# Altium schematic sheet LTEW_User_Interface.SchDoc: LTEW_User_Interface
size 420 x 297 mm; Author: Tristan Traiber; CompanyName: HES-SO; DrawnBy: Tristan Traiber; Engineer: Tristan Traiber; Organization: MSE HES-SO; Address1: HEVS; Address3: Tristan Traiber; DocumentNumber: 5; Revision: 1.0; SheetNumber: 5; SheetTotal: 6
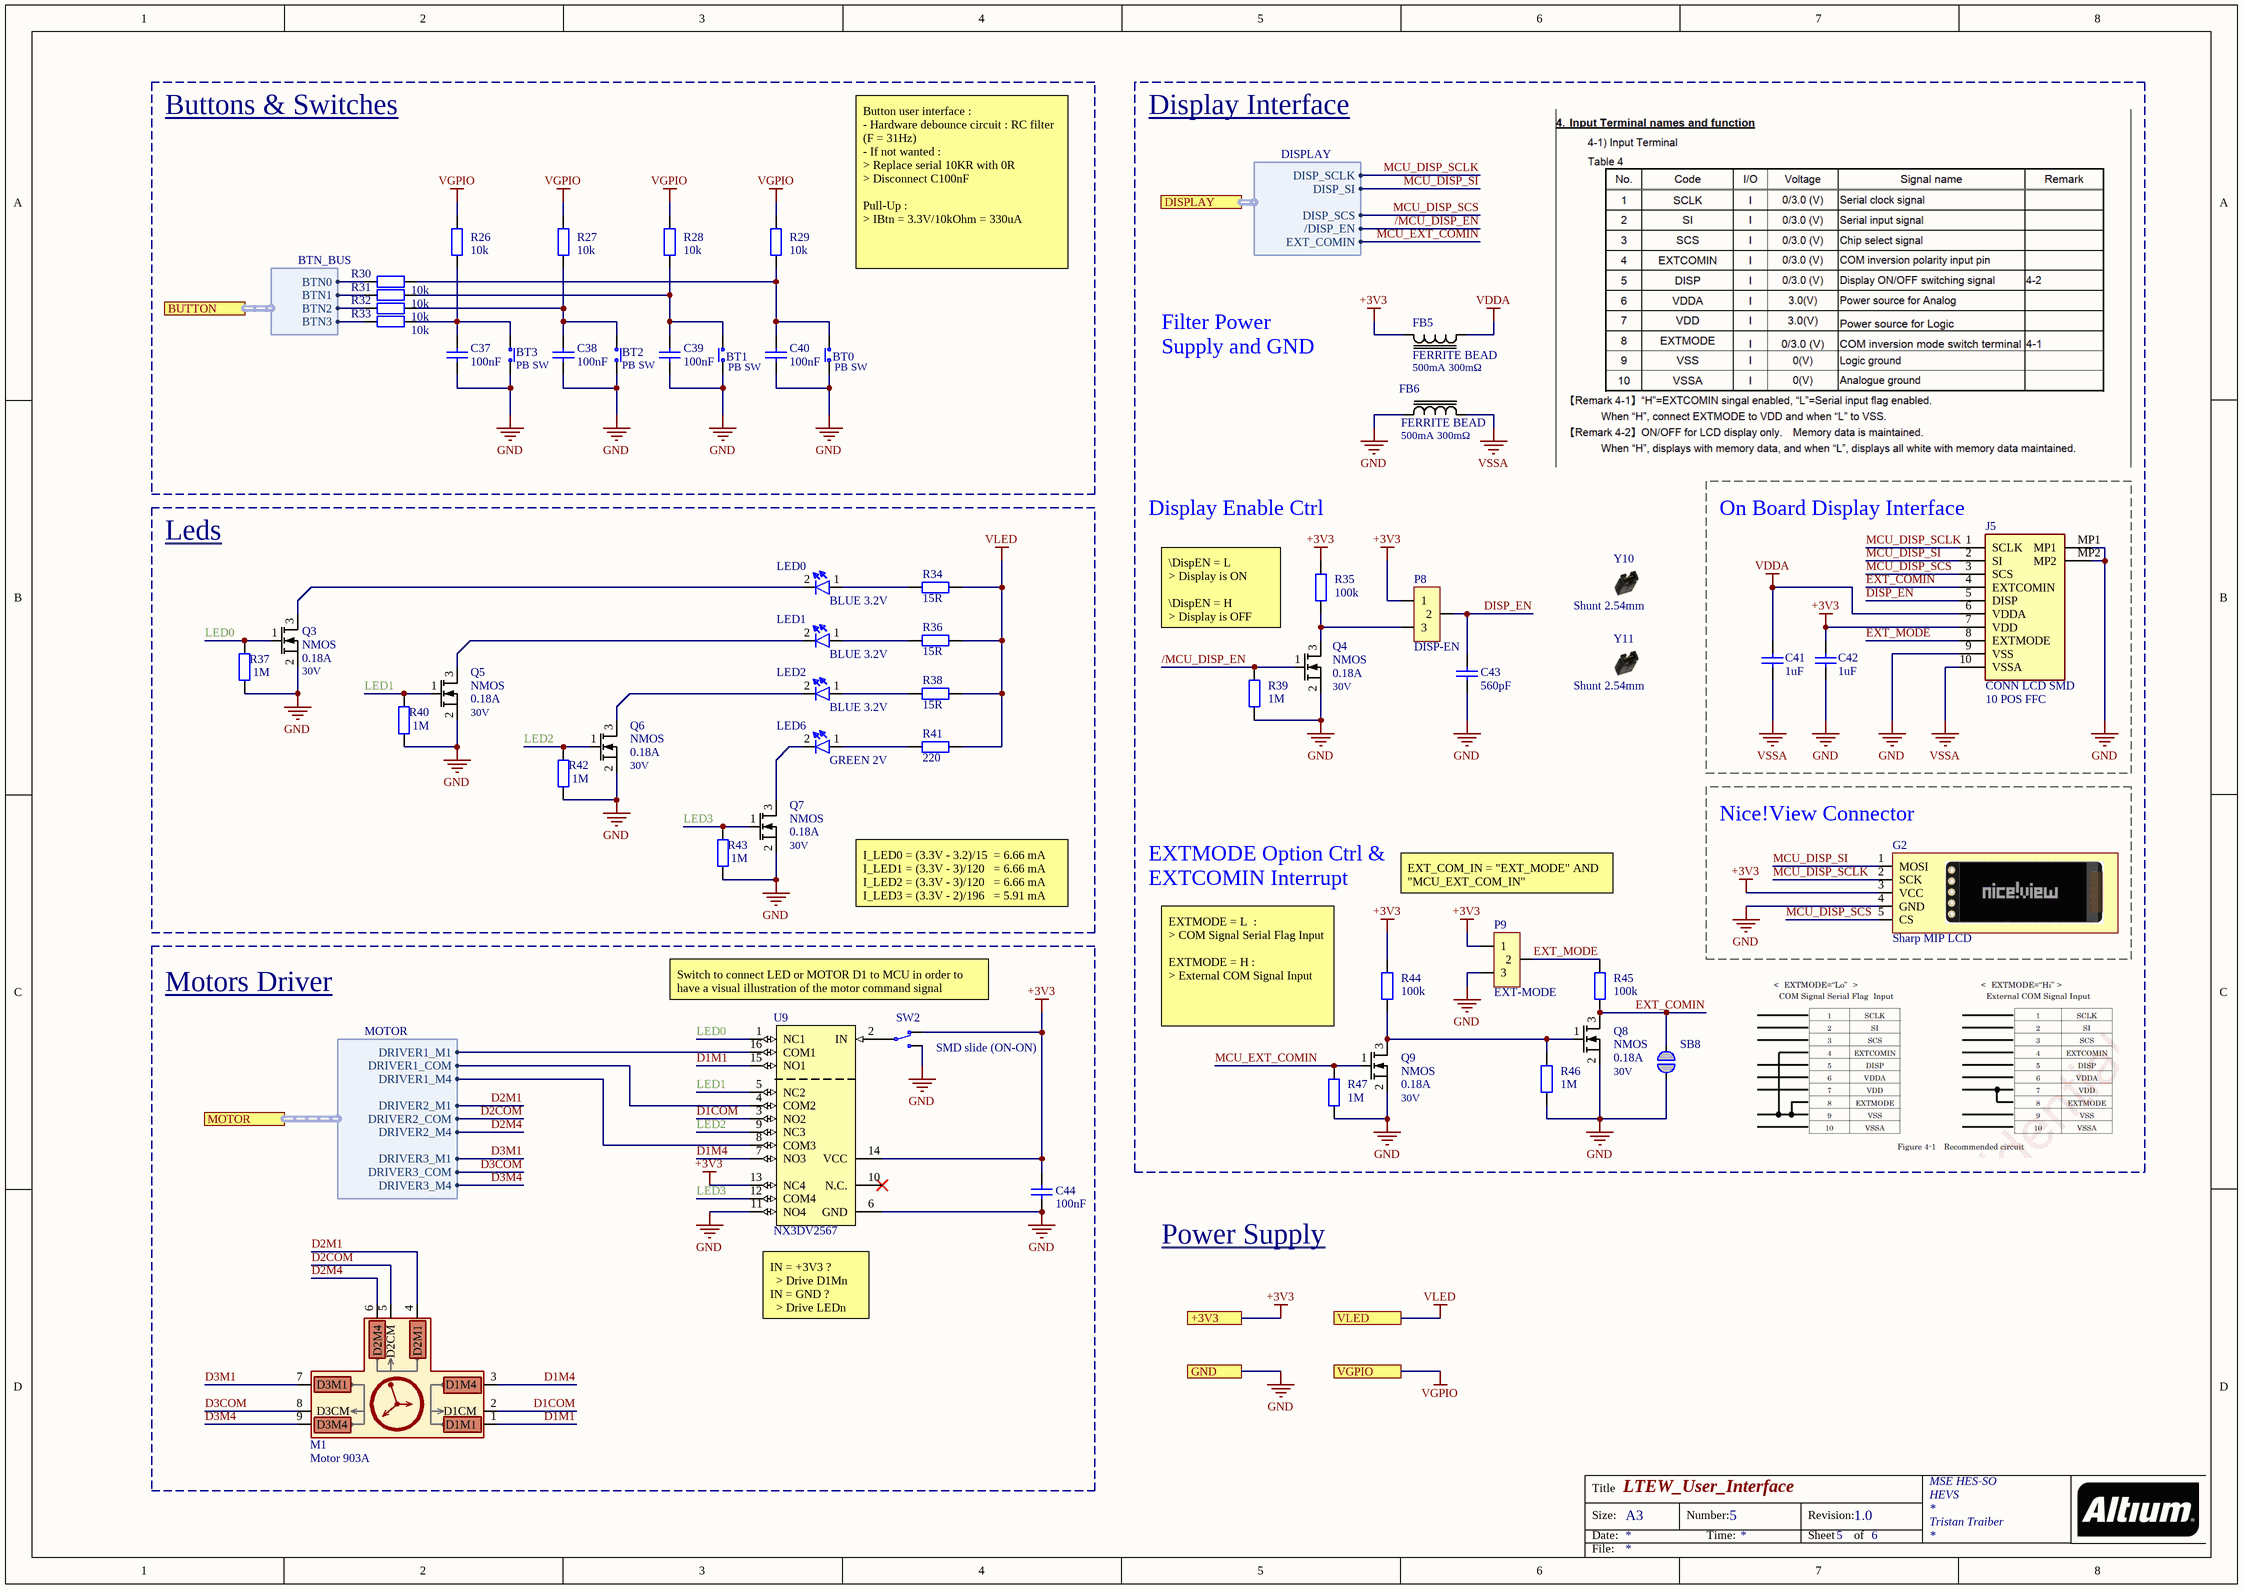
[diagram p0: LTEW_User_Interface.SchDoc]

## Parts
BT0  value PB SW  [Switch-PB-SMD-BT0]  (hidden comment: SKHUALE010)
BT1  value PB SW  [Switch-PB-SMD-BT1]  (hidden comment: SKHUALE010)
BT2  value PB SW  [Switch-PB-SMD-BT2]  (hidden comment: SKHUALE010)
BT3  value PB SW  [Switch-PB-SMD-BT3]  (hidden comment: SKHUALE010)
C37  100nF  [C0603]
C38  100nF  [C0603]
C39  100nF  [C0603]
C40  100nF  [C0603]
C41  1uF  [C0603]
C42  1uF  [C0603]
C43  560pF  [C0603]
C44  100nF  [C0603]
FB5  FERRITE BEAD  value 500mA 300mΩ  [BEADC2012X110N]
FB6  FERRITE BEAD  value 500mA 300mΩ  [BEADC2012X110N]
G2  Sharp MIP LCD  [SHARP_MIP_LCD]
J5  CONN LCD SMD  value 10 POS FFC  [FH12A10S05SH55]
LED0  BLUE 3.2V  [LEDC1608X80N]
LED1  BLUE 3.2V  [LEDC1608X80N]
LED2  BLUE 3.2V  [LEDC1608X80N]
LED6  GREEN 2V  [LEDC1608X80N]
M1  Motor 903A  [MOTOR]  (mechanical)
P8  DISP-EN  [HDR1X3 - DISP_EN]
P9  EXT-MODE  [HDR1X3 - EXT_MODE]
Q3  NMOS  value 30V  Value2: 0.18A  [SOT65P210X110-3N]
Q4  NMOS  value 30V  Value2: 0.18A  [SOT65P210X110-3N]
Q5  NMOS  value 30V  Value2: 0.18A  [SOT65P210X110-3N]
Q6  NMOS  value 30V  Value2: 0.18A  [SOT65P210X110-3N]
Q7  NMOS  value 30V  Value2: 0.18A  [SOT65P210X110-3N]
Q8  NMOS  value 30V  Value2: 0.18A  [SOT65P210X110-3N]
Q9  NMOS  value 30V  Value2: 0.18A  [SOT65P210X110-3N]
R26  10k  [RES0603]
R27  10k  [RES0603]
R28  10k  [RES0603]
R29  10k  [RES0603]
R30  10k  [RES0603]
R31  10k  [RES0603]
R32  10k  [RES0603]
R33  10k  [RES0603]
R34  15R  [RES0603]
R35  100k  [RES0603]
R36  15R  [RES0603]
R37  1M  [RES0603]
R38  15R  [RES0603]
R39  1M  [RES0603]
R40  1M  [RES0603]
R41  220  [RES0603]
R42  1M  [RES0603]
R43  1M  [RES0603]
R44  100k  [RES0603]
R45  100k  [RES0603]
R46  1M  [RES0603]
R47  1M  [RES0603]
SB8  Solderbridge  [Solderbridge]  (value not drawn)  (no BOM)
SW2  SMD slide (ON-ON)  [CJS-120xA - M/L]
U9  NX3DV2567  [XQFN40P180X260X50-16N]
Y10  Shunt 2.54mm  [Shunt_2.54mm_Horizontal]
Y11  Shunt 2.54mm  [Shunt_2.54mm_Horizontal]

## Blocks framed on the sheet
Buttons & Switches: BT0-BT3 C37-C40 R26-R33
Display Interface: C41-C43 FB5 FB6 G2 J5 P8 P9 Q4 Q8 Q9 R35 R39 R44-R47 SB8 Y10 Y11
Leds: LED0-LED2 LED6 Q3 Q5-Q7 R34 R36-R38 R40-R43
Motors Driver: C44 M1 SW2 U9

## Ports
+3V3, BUTTON (harness BTN_BUS), DISPLAY (harness DISPLAY), GND, MOTOR (harness MOTOR), VGPIO, VLED

## Harnesses
BTN_BUS: BTN0, BTN1, BTN2, BTN3
DISPLAY: DISP_SCLK, DISP_SCS, DISP_SI, /DISP_EN, EXT_COMIN
MOTOR: DRIVER1_M1, DRIVER1_COM, DRIVER2_M1, DRIVER2_COM, DRIVER2_M4, DRIVER3_M1, DRIVER3_COM, DRIVER3_M4, DRIVER1_M4

## Nets
+3V3: C42.2 C44.2 FB5.2 G2.3(VCC) J5.7(VDD) P8.1 P9.1 R35.2 R44.2 SW2.1(N.C) U9.13(NC4) U9.14(VCC) ; port +3V3
GND: BT0.2(COM) BT1.2(COM) BT2.1(N.O) BT3.1(N.O) C37.1 C38.1 C39.1 C40.1 C42.1 C43.1 C44.1 FB6.1 G2.4(GND) J5.9(VSS) J5.MP1 J5.MP2 P9.3 Q3.2(S) Q4.2(S) Q5.2(S) Q6.2(S) Q7.2(S) Q8.2(S) Q9.2(S) R37.1 R39.1 R40.1 R42.1 R43.1 R46.1 R47.1 SB8.2 SW2.3(N.O) U9.6(GND) U9.11(NO4) ; port GND
VDDA: C41.2 FB5.1 J5.6(VDDA)
VGPIO: R26.2 R27.2 R28.2 R29.2 ; port VGPIO
VLED: R34.2 R36.2 R38.2 R41.2 ; port VLED
VSSA: C41.1 FB6.2 J5.10(VSSA)
/MCU_DISP_EN: Q4.1(G) R39.2 ; port DISPLAY./DISP_EN
D1COM: M1.2(D1CM) U9.3(NO2)
D1M1: M1.1(D1M1) U9.15(NO1)
D1M4: M1.3(D1M4) U9.7(NO3)
D2COM: M1.5(D2CM) ; port MOTOR.DRIVER2_COM
D2M1: M1.4(D2M1) ; port MOTOR.DRIVER2_M1
D2M4: M1.6(D2M4) ; port MOTOR.DRIVER2_M4
D3COM: M1.8(D3CM) ; port MOTOR.DRIVER3_COM
D3M1: M1.7(D3M1) ; port MOTOR.DRIVER3_M1
D3M4: M1.9(D3M4) ; port MOTOR.DRIVER3_M4
DISP_EN: C43.2 J5.5(DISP) P8.2
EXT_COMIN: J5.4(EXTCOMIN) Q8.3(D) R45.1 SB8.1
EXT_MODE: J5.8(EXTMODE) P9.2 R45.2
LED0: Q3.1(G) R37.2 U9.1(NC1)
LED1: Q5.1(G) R40.2 U9.5(NC2)
LED2: Q6.1(G) R42.2 U9.9(NC3)
LED3: Q7.1(G) R43.2 U9.12(COM4)
MCU_DISP_SCLK: G2.2(SCK) J5.1(SCLK) ; port DISPLAY.DISP_SCLK
MCU_DISP_SCS: G2.5(CS) J5.3(SCS) ; port DISPLAY.DISP_SCS
MCU_DISP_SI: G2.1(MOSI) J5.2(SI) ; port DISPLAY.DISP_SI
MCU_EXT_COMIN: Q9.1(G) R47.2 ; port DISPLAY.EXT_COMIN
NetBT0_1: BT0.1(N.O) C40.2 R29.1 R30.2
NetBT1_1: BT1.1(N.O) C39.2 R28.1 R31.2
NetBT2_2: BT2.2(COM) C38.2 R27.1 R32.2
NetBT3_2: BT3.2(COM) C37.2 R26.1 R33.2
NetLED0_1: LED0.1(A) R34.1
NetLED0_2: LED0.2(K) Q3.3(D)
NetLED1_1: LED1.1(A) R36.1
NetLED1_2: LED1.2(K) Q5.3(D)
NetLED2_1: LED2.1(A) R38.1
NetLED2_2: LED2.2(K) Q6.3(D)
NetLED6_1: LED6.1(A) R41.1
NetLED6_2: LED6.2(K) Q7.3(D)
NetP8_3: P8.3 Q4.3(D) R35.1
NetQ8_1: Q8.1(G) Q9.3(D) R44.1 R46.2
NetR30_1: R30.1 ; port BUTTON.BTN0
NetR31_1: R31.1 ; port BUTTON.BTN1
NetR32_1: R32.1 ; port BUTTON.BTN2
NetR33_1: R33.1 ; port BUTTON.BTN3
NetSW2_2: SW2.2(COM) U9.2(IN)
NetU9_4: U9.4(COM2) ; port MOTOR.DRIVER1_COM
NetU9_8: U9.8(COM3) ; port MOTOR.DRIVER1_M4
NetU9_16: U9.16(COM1) ; port MOTOR.DRIVER1_M1

Not connected (* = marked no-connect by the designer): U9 10(N.C.)*

## Notes on the sheet
- Button user interface :
  - Hardware debounce circuit : RC filter (F = 31Hz)
  - If not wanted :
  > Replace serial 10KR with 0R
  > Disconnect C100nF
  Pull-Up :
  > IBtn = 3.3V/10kOhm = 330uA
- Filter Power Supply and GND
- (near J5) On Board Display Interface
- (near R35) Display Enable Ctrl
- \DispEN = L
  > Display is ON
  \DispEN = H
  > Display is OFF
- (near G2) Nice!View Connector
- I_LED0 = (3.3V - 3.2)/15  = 6.66 mA
  I_LED1 = (3.3V - 3)/120   = 6.66 mA
  I_LED2 = (3.3V - 3)/120   = 6.66 mA
  I_LED3 = (3.3V - 2)/196   = 5.91 mA
- EXTMODE Option Ctrl & EXTCOMIN Interrupt
- EXT_COM_IN = "EXT_MODE" AND "MCU_EXT_COM_IN"
- Switch to connect LED or MOTOR D1 to MCU in order to have a visual illustration of the motor command signal
- EXTMODE = L  :
  > COM Signal Serial Flag Input
  EXTMODE = H :
  > External COM Signal Input
- Power Supply
- (near U9) IN = +3V3 ?
  > Drive D1Mn
  IN = GND ?
  > Drive LEDn
- Title
- Size:
- Date:
- A3
- Number:
- Time:
- Revision:
- Sheet
- of
- File:

## Library data of the parts
BT0-BT3 = SW_SMD_PB: Tactile Switch, SPNO, SMD, 160gf, 6.2x6.3x2.5mm; Manufacturer_Name: Alps Alpine; Pad Count: 4; ComponentLink1URL: N.A.; ComponentLink1Description: Datasheet; ComponentLink2URL: N.A.; ComponentLink2Description: Supplier link; Supplier Part Number 2: 688-SKHUALE010; PartId: 101500001; Component Class: Switches; Supplier 1: Mouser; Supplier Part Number 1: 688-SKHUALE010; Manufacturer_Part_Number: SKHUALE010; Unit Price: 0.76
C37-C40 C44 = C_100n: 0.1 µF ±10% 25V Condensateurs céramique X7R 0603 (1608 métrique); Manufacturer_Part_Number: CL10B104KA8NNNC; Manufacturer_Name: Samsung Electro-Mechanics; Supplier 1: Digi-Key; Value: 100nF; Supplier Part Number 1: 1276-1006-1-ND; Unit Price: 0.10
C41 C42 = C_1u: 1 µF ±10% 25V Ceramic Capacitor X7R 0603 (1608 Metric); Manufacturer_Part_Number: CL10B105KA8NNNC; Manufacturer_Name: Samsung Electro-Mechanics; Supplier 1: Mouser; Supplier Part Number 1: 187-CL10B105KA8NNNC; Value: 1uF; Price Unit: 0.10
C43 = C_560p: 560 pF ±5% 25V Ceramic Capacitor C0G, NP0 0603 (1608 Metric); Manufacturer_Part_Number: CC0603JRNPO8BN561; Manufacturer_Name: YAGEO; Value: 560pF; Supplier 1: Digi-Key; Supplier Part Number 1: 311-3957-1-ND; Unit Price: 0.110
FB5 FB6 = L_FerritBead: 600 Ohms @ 100 MHz 1 Power, Signal Line Ferrite Bead 0805 (2012 Metric) 500mA 300mOhm; Manufacturer_Name: Laird Performance Materials; Manufacturer_Part_Number: HZ0805E601R-10; Datasheet Link: https://www.laird.com/sites/default/files/hz0805e601r-10-datasheet.pdf; Height: 1.1mm; Supplier 1: Digi-Key; Supplier Part Number 1: 240-2399-1-ND; Unit Price: 0.19
G2 = Display: 503535 3.8v 580mAh round lipo battery cells / (Order : shorturl.at/tEFMZ); Manufacturer_Part_Number: LS011B7DH03; ComponentLink1Description: Order; ComponentLink1URL: https://keycapsss.com/keyboard-parts/parts/219/nice-view-1.08-e-paper-display; Value: Sharp MIP LCD; ComponentLink2Description: Info; ComponentLink2URL: https://nicekeyboards.com/docs/nice-view/getting-started/; Manufacturer_Name: Sharp; Supplier Part Number 1: https://keycapsss.com/keyboard-parts/parts/219/nice-view-1.08-e-paper-display; Unit Price: 21.00
J5 = CONN_LCD_FFC12: 10 Position FFC, FPC Connector Contacts, Top 0.020" (0.50mm) Surface Mount, Right Angle; Manufacturer_Name: Hirose; Manufacturer_Part_Number: FH12A-10S-0.5SH(55); Datasheet Link: https://componentsearchengine.com/Datasheets/1/FH12A-10S-0.5SH(55).pdf; Height: 3.6mm; Supplier 1: Digi-Key; Supplier Part Number 1: HFK110CT-ND; Unit Price: 1.34
LED0-LED2 = LED_B: Blue 470nm LED Indication - Discrete 3.2V 0603 (1608 Metric); Manufacturer_Name: Würth Elektronik; Manufacturer_Part_Number: 150060BS75000; Datasheet Link: http://www.qt-brightek.com/datasheet/QBLP617_series.pdf; Height: 1.3mm; Supplier 1: Digi-Key; Supplier Part Number 1: 732-4966-1-ND; Unit Price: 0.17
LED6 = LED_G: Green 570nm LED Indication - Discrete 2V 0603 (1608 Metric); Manufacturer_Name: QT Brightek (QTB); Manufacturer_Part_Number: 150060VS75000; Datasheet Link: http://www.qt-brightek.com/datasheet/QBLP617_series.pdf; Height: 1.3mm; Supplier 1: Digi-Key; Supplier Part Number 1: 732-4980-1-ND; Unit Price: 0.15
M1 = MOTOR_903A: Titan 903A : 3 Hands Bidirectional, independent motor; Assembly: Not Mounted; LatestRevisionDate: 17-Jul-2002; LatestRevisionNote: Re-released for DXP Platform.; Publisher: Altium Limited
P8 P9 = H_3POS: Header, 3-Pin; Manufacturer_Name: Harwin Inc.; Manufacturer_Part_Number: M20-9990345; Supplier 1: Digi-key; Supplier Part Number 1: 952-2263-ND; Unit Price: 0.17
Q3-Q9 = MOS-N: N-Channel 30 V 180mA (Ta) 260mW (Ta), 1.1W (Tc) Surface Mount SOT-323; Manufacturer_Name: NXP; Manufacturer_Part_Number: NX3020NAKW; Datasheet Link: https://datasheetspdf.com/pdf-file/1379402/nexperia/NX3020NAKW/1; Height: 1.1mm; Supplier 1: Digi-Key; Supplier Part Number 1: 1727-1288-1-ND; Unit Price: 0.30
R26-R33 = R_10k: 10 kOhms ±1% 0.1W, 1/10W Chip Resistor 0603 (1608 Metric) Moisture Resistant Thick Film; Manufacturer_Part_Number: RC0805FR-0710KL; Manufacturer_Name: YAGEO; Supplier 1: Digi-Key; Supplier Part Number 1: 311-10.0KHRCT-ND; Value: 10k; Unit Price: 0..10
R34 R36 R38 = R_15: 15 Ohms ±1% 0.1W, 1/10W Chip Resistor 0603 (1608 Metric) Moisture Resistant Thick Film; Manufacturer_Part_Number: RC0603FR-0715RL; Manufacturer_Name: YAGEO; Value: 15R; Unit Price: 0.10; Supplier 1: Digi-Key; Supplier Part Number 1: 311-15.0HRTR-ND
R35 R44 R45 = R_100k: RES SMD 100K OHM 1% 1/8W 0603; Manufacturer_Part_Number: RC0805FR-07100KL; Manufacturer_Name: YAGEO; Supplier 1: Digi-Key; Supplier Part Number 1: 311-100KCRCT-ND; Value: 100k; Unit Price: 0.10
R37 R39 R40 R42 R43 R46 R47 = R_1M: 1 MOhms ±1% 0.1W, 1/10W Chip Resistor 0603 (1608 Metric) Automotive AEC-Q200 Thick Film; Manufacturer_Part_Number: ERJ-3EKF1004V; Manufacturer_Name: YAGEO; Value: 1M; Supplier 1: Digi-Key; Supplier Part Number 1: P1.00MHCT-ND; Unit Price: 0.10
R41 = R_220: 220 Ohms ±1% 0.1W, 1/10W Chip Resistor 0603 (1608 Metric) Moisture Resistant Thick Film; Manufacturer_Part_Number: CR0603-FX-3300ELF; Manufacturer_Name: YAGEO; Value: 220; Unit Price: 0.10; Supplier 1: Digi-Key; Supplier Part Number 1: 311-220HRTR-ND
SB8 = Solderbridge: Manufacturer: N.A.; Pad Count: 2; Part Number: Solderbridge; Manufacturer Part Number: N.A.; LatestRevisionDate: 2009-12-14; Published: 2009-12-14; Value: Solderbridge; Note: N.A.; Artikkelnr Noca: N.A.; Footprint Doc: Solderbridge; Part number IPS: N.A.; ComponentLink1URL: N.A.; ComponentLink1Description: Datasheet; ComponentLink2URL: N.A.; ComponentLink2Description: Supplier link; HelpURL: N.A.; Supplier 1: N.A.; Supplier Part Number 1: N.A.; Supplier 2: N.A.; Supplier Part Number 2: N.A.; PartId: 100500458; Component Class: Connectors
SW2 = SW_2POS: SMD slide Switch (ON-ON); Manufacturer_Part_Number: CJS-1200TA; Manufacturer_Name: Nidec Copal Electronics; ComponentLink1URL: N.A.; ComponentLink1Description: Datasheet; ComponentLink2URL: N.A.; ComponentLink2Description: Supplier link; Supplier 1: Mouser; Supplier Part Number 1: 229-CJS-1200TA; Value: SMD slide (ON-ON); Unit Price: 0.73
U9 = NX3DV2567GU: Low-ohmic four-pole double-throw analog switch; Manufacturer_Name: NXP Semiconductors; Manufacturer Part Number: NX3DV2567GU; Value: NX3DV2567; ComponentLink1URL: N.A.; ComponentLink1Description: Datasheet; ComponentLink2URL: N.A.; ComponentLink2Description: Supplier link; Supplier 1: Mouser; Supplier Part Number 1: 771-NX3DV2567GU115; Unit Price: 0.92
Y10 Y11 = SHUNT JUMPER 2.54mm BLACK GOLD Horizontal: Shunt Jumper 2.54mm Black; Manufacturer Part Number: SPC02SYAN; Manufacturer_Name: Sullins Connector Solutions; ComponentLink1URL: N.A.; ComponentLink1Description: Datasheet; ComponentLink2URL: N.A.; ComponentLink2Description: Supplier link; Footprint Doc: SHUNT JUMPER 2.54mm; Value: Shunt 2.54mm; Component Class: Connectors; Supplier 1: Digi-Key; Supplier Part Number 1: S9001-ND; Unit Price: 0.10